# Altium schematic sheet Serial.SchDoc
size A
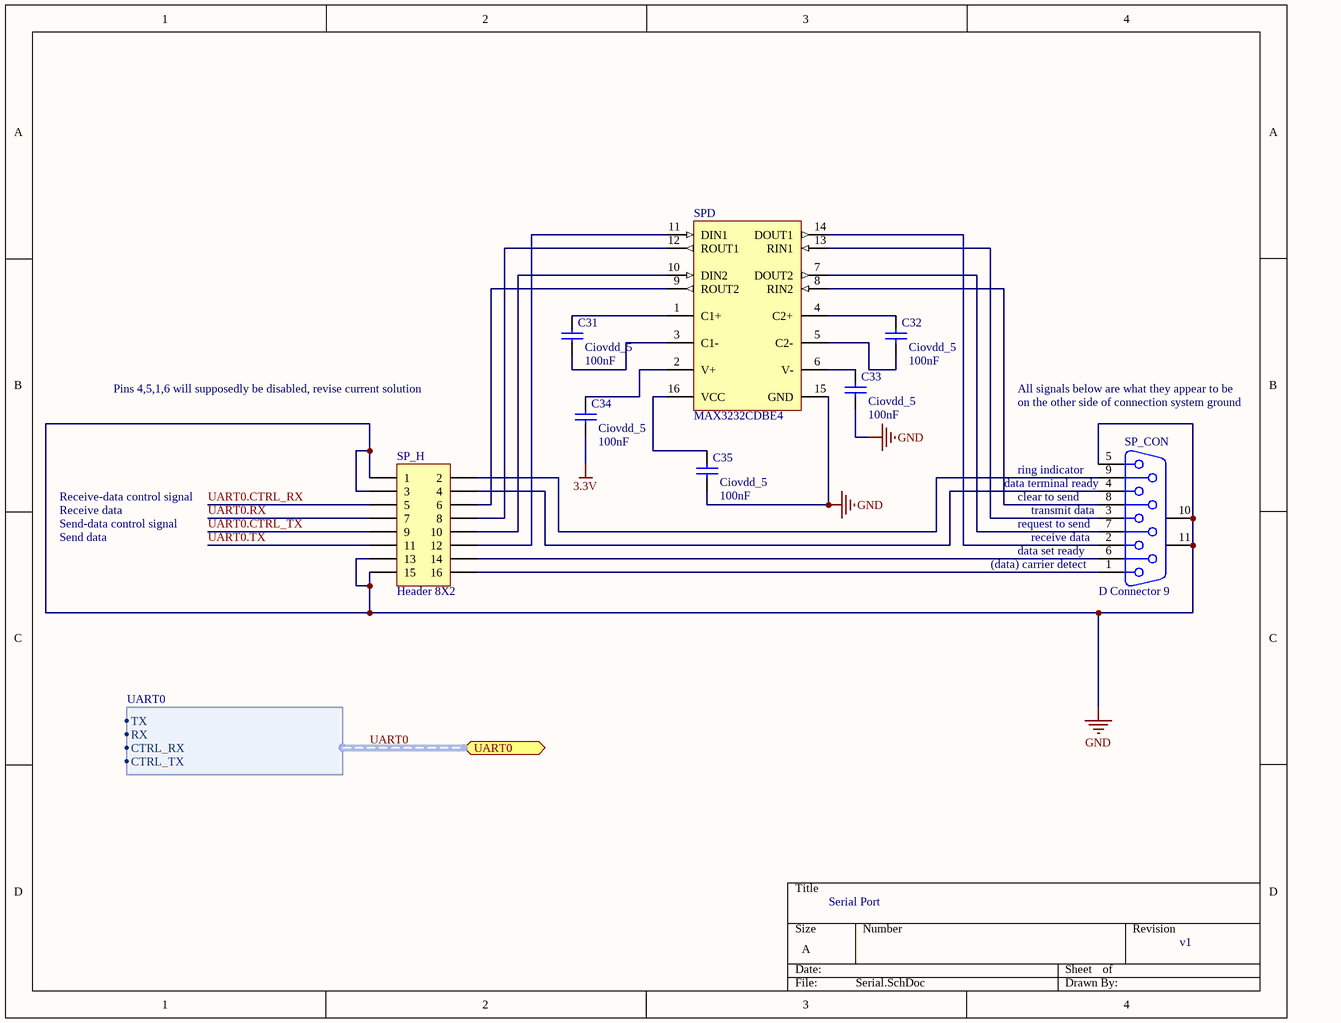
[diagram p0: Serial.SchDoc]

## Parts
C31  Ciovdd_5  value 100nF  [C1206]
C32  Ciovdd_5  value 100nF  [C1206]
C33  Ciovdd_5  value 100nF  [C1206]
C34  Ciovdd_5  value 100nF  [C1206]
C35  Ciovdd_5  value 100nF  [C1206]
SP_CON  D Connector 9  [DSUB1.385-2H9]
SP_H  Header 8X2  [HDR2X8]
SPD  MAX3232CDBE4  [TI-DB16_L]

## Ports
UART0 (harness UART0)

## Harnesses
UART0: TX, RX, CTRL_RX, CTRL_TX

## Nets
3.3V: C34.1
GND: C33.1 C35.1 SP_CON.5 SP_CON.10(MH1) SP_CON.11(MH2) SP_H.1 SP_H.3 SP_H.13 SP_H.15 SPD.15(GND)
UART0.CTRL_RX: SP_H.5
UART0.CTRL_TX: SP_H.9
UART0.RX: SP_H.7
UART0.TX: SP_H.11
NetC31_1: C31.1 SPD.3(C1-)
NetC31_2: C31.2 SPD.1(C1+)
NetC32_1: C32.1 SPD.5(C2-)
NetC32_2: C32.2 SPD.4(C2+)
NetC33_2: C33.2 SPD.6(V-)
NetC34_2: C34.2 SPD.2(V+)
NetC35_2: C35.2 SPD.16(VCC)
NetSP_CON_1: SP_CON.1 SP_H.16
NetSP_CON_2: SP_CON.2 SPD.14(DOUT1)
NetSP_CON_3: SP_CON.3 SPD.13(RIN1)
NetSP_CON_4: SP_CON.4 SP_H.4
NetSP_CON_6: SP_CON.6 SP_H.14
NetSP_CON_7: SP_CON.7 SPD.7(DOUT2)
NetSP_CON_8: SP_CON.8 SPD.8(RIN2)
NetSP_CON_9: SP_CON.9 SP_H.2
NetSP_H_6: SP_H.6 SPD.9(ROUT2)
NetSP_H_8: SP_H.8 SPD.12(ROUT1)
NetSP_H_10: SP_H.10 SPD.10(DIN2)
NetSP_H_12: SP_H.12 SPD.11(DIN1)

## Buses and harness runs
harness UART0 = port UART0

## Notes on the sheet
- Pins 4,5,1,6 will supposedly be disabled, revise current solution
- on the other side of connection system ground
- All signals below are what they appear to be
- Receive-data control signal
- (near SP_CON) data terminal ready
- (near SP_CON) clear to send
- (near SP_CON) ring indicator
- Send data
- Send-data control signal
- Receive data
- (near SP_CON) (data) carrier detect
- (near SP_CON) request to send
- (near SP_CON) data set ready
- (near SP_CON) transmit data
- (near SP_CON) receive data
- Serial Port
- v1

## Library data of the parts
C31-C35 = Cap Semi: Capacitor (Semiconductor SIM Model); Manufacturer: AVX; Manufacturer Part Number: 02016D104KAT2A; Capacitance: 0.1; Capacitance Tolerance: ± 10%; Dielectric Characteristic: X5; Voltage Rating: 6.3; Ceramic Capacitor Case: 0201 [0603 Metric]; SVHC: No SVHC (16-Dec-2013); Capacitor Terminals: SMD; Reel Quantity: 15000; Published: 8-Jun-2000; LatestRevisionDate: 29-May-2009; LatestRevisionNote: IPC-7351 Footprint Added.; PackageReference: C1206; Publisher: Altium Limited; PackageDescription: Chip Capacitor; Supplier 1: Farnell; Supplier Part Number 1: 2280755; RoHS: YES; Stock 1: 30000; Pricing 1: 15000=0.0827, 75000=0.062, 150000=0.0517 (EUR); Product Range: -; Operating Temperature Min: -55; Operating Temperature Max: 85; Packaging: Tape & Reel; MSL: MSL 1 - Unlimited; Capacitance Tolerance ±: ± 10%; Capacitor Case Style: 0201 [0603 Metric]; Operating Temperature Range: -55°C to +85; ComponentLink1URL: http://www.farnell.com/datasheets/1666675.pdf; ComponentLink1Description: http://www.farnell.com/datasheets/1666675.pdf
SP_CON = D Connector 9: Receptacle Assembly, 9 Position, Right Angle; PackageDocument: O; Positions: 9; Published: 15-Jun-2001; LatestRevisionDate: 17-Jul-2002; LatestRevisionNote: Re-released for DXP Platform.; DatasheetDocument: 1-Sep-1999; PackageReference: 788750; Publisher: Altium Limited; Orientation: Right Angle; Gender: Receptacle
SP_H = Header 8X2: Header, 8-Pin, Dual row; LatestRevisionDate: 17-Jul-2002; LatestRevisionNote: Re-released for DXP Platform.; Publisher: Altium Limited
SPD = CMP-0299-01177-1: 3-V to 5.5-V Multichannel RS-232 Line Driver / Receiver with ±15-kV ESD Protection, 0 to 70 degC, 16-Pin SSOP (DB), Green (RoHS & no Sb/Br); RS-232: TRUE; Supply Voltage(s)(V): 3.3 or 5.0; ESD HBM(kV): +/-15; ICC(Max)(mA): 1; Drivers Per Package: 2; SubFamily: RS-232; ComponentLink1URL: www.ti.com; ComponentLink3Description: Package Specification; PackageDescription: 16-Pin Plastic Small Outline Package, 6.2 x 5.3 mm Body, 0.65 mm Pitch; ComponentLink2URL: http://www.ti.com/general/docs/lit/getliterature.tsp?genericPartNumber=MAX3232&fileType=pdf; Single Supply: TRUE; ComponentLink3URL: http://www.ti.com/litv/pdf/msso002e; PackageVersion: revE, Dec-2001; ComponentLink1Description: Manufacturer URL; ComponentLink2Description: Datasheet; Receivers Per Package: 2; DatasheetVersion: SLLS410I; PackageReference: DB16